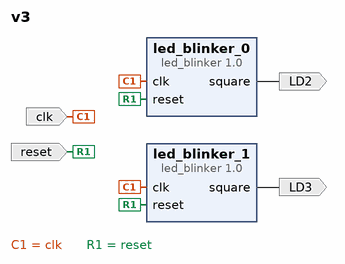
[diagram p0: block diagram of the top level]
# Vivado block design v3, xc7z020clg484-1, Vivado 2020.2
create_bd_design v3

create_bd_port -dir I clk
create_bd_port -dir I reset
create_bd_port -dir O LD2
create_bd_port -dir O LD3

create_bd_cell -type ip -vlnv ESDL:user:led_blinker:1.0 led_blinker_0
set_property -dict {CONFIG.CLK_divider_width 26} [get_bd_cells led_blinker_0]
create_bd_cell -type ip -vlnv ESDL:user:led_blinker:1.0 led_blinker_1
set_property -dict {CONFIG.CLK_divider_width 28} [get_bd_cells led_blinker_1]

# ---- connections ----

connect_bd_net -net clk_0_1 [get_bd_ports clk] [get_bd_pins led_blinker_0/clk] [get_bd_pins led_blinker_1/clk]
connect_bd_net -net reset_0_1 [get_bd_ports reset] [get_bd_pins led_blinker_0/reset] [get_bd_pins led_blinker_1/reset]
connect_bd_net [get_bd_pins led_blinker_0/square] [get_bd_ports LD2]
connect_bd_net [get_bd_pins led_blinker_1/square] [get_bd_ports LD3]

validate_bd_design
save_bd_design
